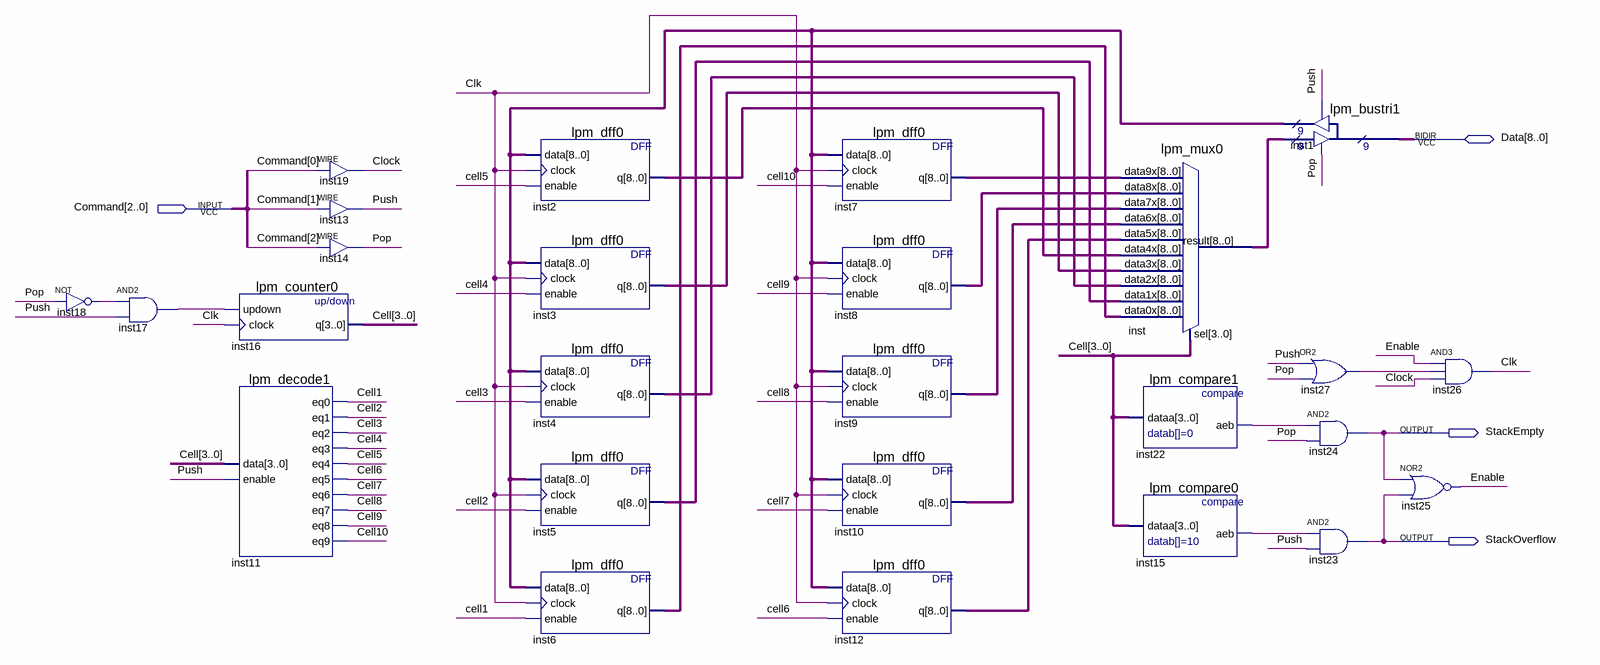
[diagram p0: schematic sheet]
// Quartus schematic StackBlock.bdf as structural Verilog: 26 symbols, 4 pins
module StackBlock (
  input  [2:0] Command,
  inout  [8:0] Data,
  output StackEmpty,
  output StackOverflow
);

  wire cell4, cell5, cell6, cell7, cell8, cell9, cell10, Clk, Clock, Enable, inst15_aeb, inst17_out,
       inst18_out, inst22_aeb, inst27_out, Pop, Push;
  wire [3:0] Cell;
  wire [8:0] inst1_result, inst2_q, inst3_q, inst4_q, inst5_q, inst6_q, inst7_q, inst8_q, inst9_q, inst10_q,
       inst12_q, inst_result;

  not inst18 (inst18_out, Pop);
  and inst17 (inst17_out, inst18_out, Push);
  lpm_counter0 inst16 (.updown(inst17_out), .clock(Clk), .q(Cell));
  lpm_decode1 inst11 (
    .data(Cell), .enable(Push), .eq0(Cell[1]), .eq1(Cell[2]), .eq2(Cell[3]), .eq3(cell4), .eq4(cell5),
    .eq5(cell6), .eq6(cell7), .eq7(cell8), .eq8(cell9), .eq9(cell10));
  assign Clock = Command[0];  // WIRE inst19
  assign Push = Command[1];  // WIRE inst13
  assign Pop = Command[2];  // WIRE inst14
  lpm_dff0 inst2 (.data(inst1_result), .clock(Clk), .enable(cell5), .q(inst2_q));
  lpm_dff0 inst3 (.data(inst1_result), .clock(Clk), .enable(cell4), .q(inst3_q));
  lpm_dff0 inst4 (.data(inst1_result), .clock(Clk), .enable(Cell[3]), .q(inst4_q));
  lpm_dff0 inst5 (.data(inst1_result), .clock(Clk), .enable(Cell[2]), .q(inst5_q));
  lpm_dff0 inst6 (.data(inst1_result), .clock(Clk), .enable(Cell[1]), .q(inst6_q));
  lpm_dff0 inst7 (.data(inst1_result), .clock(Clk), .enable(cell10), .q(inst7_q));
  lpm_dff0 inst8 (.data(inst1_result), .clock(Clk), .enable(cell9), .q(inst8_q));
  lpm_dff0 inst9 (.data(inst1_result), .clock(Clk), .enable(cell8), .q(inst9_q));
  lpm_dff0 inst10 (.data(inst1_result), .clock(Clk), .enable(cell7), .q(inst10_q));
  lpm_dff0 inst12 (.data(inst1_result), .clock(Clk), .enable(cell6), .q(inst12_q));
  lpm_mux0 inst (
    .data9x(inst7_q), .data8x(inst8_q), .data7x(inst9_q), .data6x(inst10_q), .data5x(inst12_q),
    .data4x(inst2_q), .data3x(inst3_q), .data2x(inst4_q), .data1x(inst5_q), .data0x(inst6_q), .sel(Cell),
    .result(inst_result));
  lpm_compare1 inst22 (.dataa(Cell), .aeb(inst22_aeb));
  lpm_compare0 inst15 (.dataa(Cell), .aeb(inst15_aeb));
  lpm_bustri1 inst1 (.enabledt(Pop), .data(inst_result), .enabletr(Push), .result(inst1_result), .tridata(Data));
  or inst27 (inst27_out, Push, Pop);
  and inst24 (StackEmpty, inst22_aeb, Pop);
  and inst23 (StackOverflow, inst15_aeb, Push);
  and inst26 (Clk, Enable, inst27_out, Clock);
  nor inst25 (Enable, StackEmpty, StackOverflow);
endmodule
